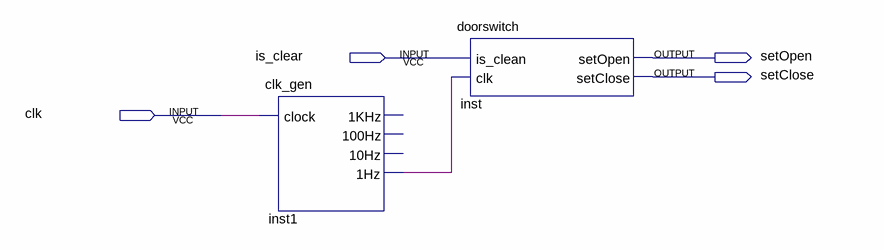
[diagram p0: schematic sheet]
// Quartus schematic doorAni.bdf as structural Verilog: 2 symbols, 4 pins
module doorAni (
  input  is_clear,
  input  clk,
  output setOpen,
  output setClose
);

  wire inst1_1hz;

  clk_gen inst1 (.clock(clk), .\1Hz (inst1_1hz));  // open: 1KHz, 100Hz, 10Hz
  doorswitch inst (.is_clean(is_clear), .clk(inst1_1hz), .setOpen(setOpen), .setClose(setClose));
endmodule
